# Altium schematic sheet CircleValve.SchDoc
size A4
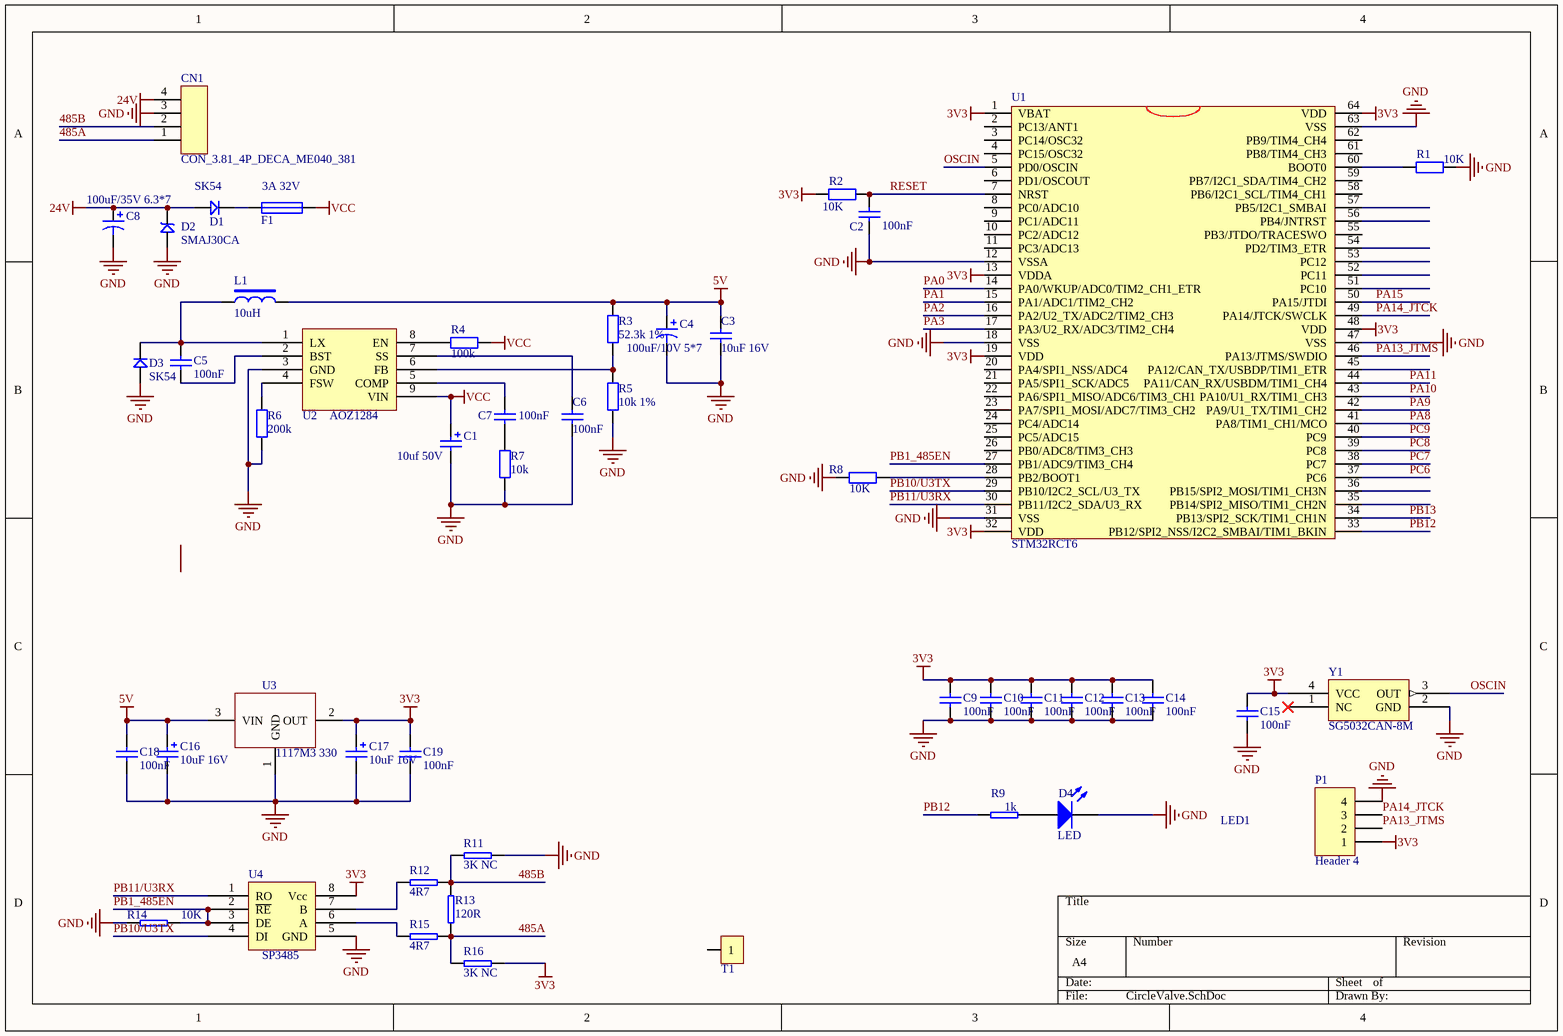
[diagram p0: CircleValve.SchDoc]

## Parts
C1  10uf 50V  [C1206]
C2  100nF  [C0603]
C3  10uF 16V  [C1206]
C4  100uF/10V 5*7  [CAP D=6mm]
C5  100nF  [C0603]
C6  100nF  [C0603]
C7  100nF  [C0603]
C8  100uF/35V 6.3*7  [CAP D=6mm]
C9  100nF  [C0603]
C10  100nF  [C0603]
C11  100nF  [C0603]
C12  100nF  [C0603]
C13  100nF  [C0603]
C14  100nF  [C0603]
C15  100nF  [C0603]
C16  10uF 16V  [C1206]
C17  10uF 16V  [C1206]
C18  100nF  [C0603]
C19  100nF  [C0603]
CN1  CON_3.81_4P_DECA_ME040_381  [ME040_381_4P_VC-1]
D1  SK54  [LC-SMA(DO-214AC)_S3]
D2  SMAJ30CA  [LC-SMA(DO-214AC)_S3]
D3  SK54  [LC-SMA(DO-214AC)_S3]
D4  LED  [LED_M]
F1  3A 32V  [C1206]
L1  10uH  [L_SOP74]
P1  Header 4  [Header4-2.54mm]
R1  10K  [R0603]
R2  10K  [R0603]
R3  52.3k 1%  [R0603]
R4  100k  [R0603]
R5  10k 1%  [R0603]
R6  200k  [R0603]
R7  10k  [R0603]
R8  10K  [R0603]
R9  1k  [R0603]
R11  3K NC  [R0603]
R12  4R7  [R0603]
R13  120R  [R0603]
R14  10K  [R0603]
R15  4R7  [R0603]
R16  3K NC  [R0603]
T1  TP  [定位孔3mm]  (value not drawn)
U1  STM32RCT6  [LC-LQFP-64_10x10x05P]
U2  AOZ1284  [LC-SOP-8_150mil]
U3  1117M3 330  [LT1117]
U4  SP3485  [SO8]
Y1  SG5032CAN-8M  [XTAL-4P-5*3MM]

## Nets
3V3: C9.2 C10.2 C11.2 C12.2 C13.2 C14.2 C15.2 C17.1 C19.2 P1.1 R2.1 R16.1 U1.1(VBAT) U1.13(VDDA) U1.19(VDD) U1.32(VDD) U1.48(VDD) U1.64(VDD) U3.2(OUT) U4.8(Vcc) Y1.4(VCC)
5V: C3.1 C4.1 C16.1 C18.2 L1.2 R3.2 U3.3(VIN)
24V: C8.1 CN1.4 D1.1 D2.2
GND: C1.2 C2.2 C3.2 C4.2 C6.2 C8.2 C9.1 C10.1 C11.1 C12.1 C13.1 C14.1 C15.1 C16.2 C17.2 C18.1 C19.1 CN1.3 D2.1 D3.1 D4.2(K) P1.4 R1.2 R5.1 R6.1 R7.1 R8.1 R11.1 R14.1 U1.12(VSSA) U1.18(VSS) U1.31(VSS) U1.47(VSS) U1.63(VSS) U2.3(GND) U3.1(GND) U4.5(GND) Y1.2(GND)
VCC: C1.1 F1.2 R4.2 U2.9(VIN)
485A: CN1.1 R13.2 R15.1 R16.2
485B: CN1.2 R11.2 R12.1 R13.1
OSCIN: U1.5(PD0/OSCIN) Y1.3(OUT)
PA0: U1.14(PA0/WKUP/ADC0/TIM2_CH1_ETR)
PA1: U1.15(PA1/ADC1/TIM2_CH2)
PA2: U1.16(PA2/U2_TX/ADC2/TIM2_CH3)
PA3: U1.17(PA3/U2_RX/ADC3/TIM2_CH4)
PA8: U1.41(PA8/TIM1_CH1/MCO)
PA9: U1.42(PA9/U1_TX/TIM1_CH2)
PA10: U1.43(PA10/U1_RX/TIM1_CH3)
PA11: U1.44(PA11/CAN_RX/USBDM/TIM1_CH4)
PA13_JTMS: P1.2 U1.46(PA13/JTMS/SWDIO)
PA14_JTCK: P1.3 U1.49(PA14/JTCK/SWCLK)
PA15: U1.50(PA15/JTDI)
PB1_485EN: R14.2 U1.27(PB1/ADC9/TIM3_CH4) U4.2(~{RE}) U4.3(DE)
PB10/U3TX: U1.29(PB10/I2C2_SCL/U3_TX) U4.4(DI)
PB11/U3RX: U1.30(PB11/I2C2_SDA/U3_RX) U4.1(RO)
PB12: R9.1 U1.33(PB12/SPI2_NSS/I2C2_SMBAI/TIM1_BKIN)
PB13: U1.34(PB13/SPI2_SCK/TIM1_CH1N)
PC6: U1.37(PC6)
PC7: U1.38(PC7)
PC8: U1.39(PC8)
PC9: U1.40(PC9)
RESET: C2.1 R2.2 U1.7(NRST)
NetC5_1: C5.1 U2.2(BST)
NetC5_2: C5.2 D3.2 L1.1 U2.1(LX)
NetC6_1: C6.1 U2.7(SS)
NetC7_1: C7.1 U2.5(COMP)
NetC7_2: C7.2 R7.2
NetD1_2: D1.2 F1.1
NetD4_1: D4.1(A) R9.2
NetR1_1: R1.1 U1.60(BOOT0)
NetR3_1: R3.1 R5.2 U2.6(FB)
NetR4_1: R4.1 U2.8(EN)
NetR6_2: R6.2 U2.4(FSW)
NetR8_2: R8.2 U1.28(PB2/BOOT1)
NetR12_2: R12.2 U4.7(B)
NetR15_2: R15.2 U4.6(A)

Not connected (* = marked no-connect by the designer): T1 1; U1 2(PC13/ANT1) 3(PC14/OSC32) 4(PC15/OSC32) 6(PD1/OSCOUT) 8(PC0/ADC10) 9(PC1/ADC11) 10(PC2/ADC12) 11(PC3/ADC13) 20(PA4/SPI1_NSS/ADC4) 21(PA5/SPI1_SCK/ADC5) 22(PA6/SPI1_MISO/ADC6/TIM3_CH1) 23(PA7/SPI1_MOSI/ADC7/TIM3_CH2) 24(PC4/ADC14) 25(PC5/ADC15) 26(PB0/ADC8/TIM3_CH3) 35(PB14/SPI2_MISO/TIM1_CH2N) 36(PB15/SPI2_MOSI/TIM1_CH3N) 45(PA12/CAN_TX/USBDP/TIM1_ETR) 51(PC10) 52(PC11) 53(PC12) 54(PD2/TIM3_ETR) 55(PB3/JTDO/TRACESWO) 56(PB4/JNTRST) 57(PB5/I2C1_SMBAI) 58(PB6/I2C1_SCL/TIM4_CH1) 59(PB7/I2C1_SDA/TIM4_CH2) 61(PB8/TIM4_CH3) 62(PB9/TIM4_CH4); Y1 1(NC)*

## Notes on the sheet
- LED1

## Library data of the parts
C1 C16 C17 = CAP1
C2 C3 C5-C7 C9-C15 C18 C19 = CAP
C4 = Cap Pol1: Polarized Capacitor (Radial); Value: 220uF/25V 8*12; Published: 8-Jun-2000; LatestRevisionDate: 17-Jul-2002; LatestRevisionNote: Re-released for DXP Platform.; PackageReference: RB7.6-15; Publisher: Altium Limited; PackageDescription: Polarized Capacitor (Radial); 2 Leads
C8 = Cap Pol1: Polarized Capacitor (Radial); Value: 220uF/50V 8*12; Published: 8-Jun-2000; LatestRevisionDate: 17-Jul-2002; LatestRevisionNote: Re-released for DXP Platform.; PackageReference: RB7.6-15; Publisher: Altium Limited; PackageDescription: Polarized Capacitor (Radial); 2 Leads
CN1 = CON_3.81_4P_DECA_ME040_381: DECA connector,3.81mm,1*4P,180度; PartNumber: ME040-381-4P; Manufacturer: DECA
D1 D3 = D: 1N4148
D2 = SMBJ: TVS
F1 = FUSE
L1 = 差模电感
P1 = Header 4: Header, 4-Pin; LatestRevisionDate: 17-Jul-2002; LatestRevisionNote: Re-released for DXP Platform.; Publisher: Altium Limited
R1-R8 = RES
R9 R11-R16 = R: 标贴电阻
U1 = STM32RBT6
U3 = LT1117
U4 = RS485
Y1 = XTAL_POWER